# EAGLE design Freescale_Dev_2G_no_usb (EAGLE 5.08)
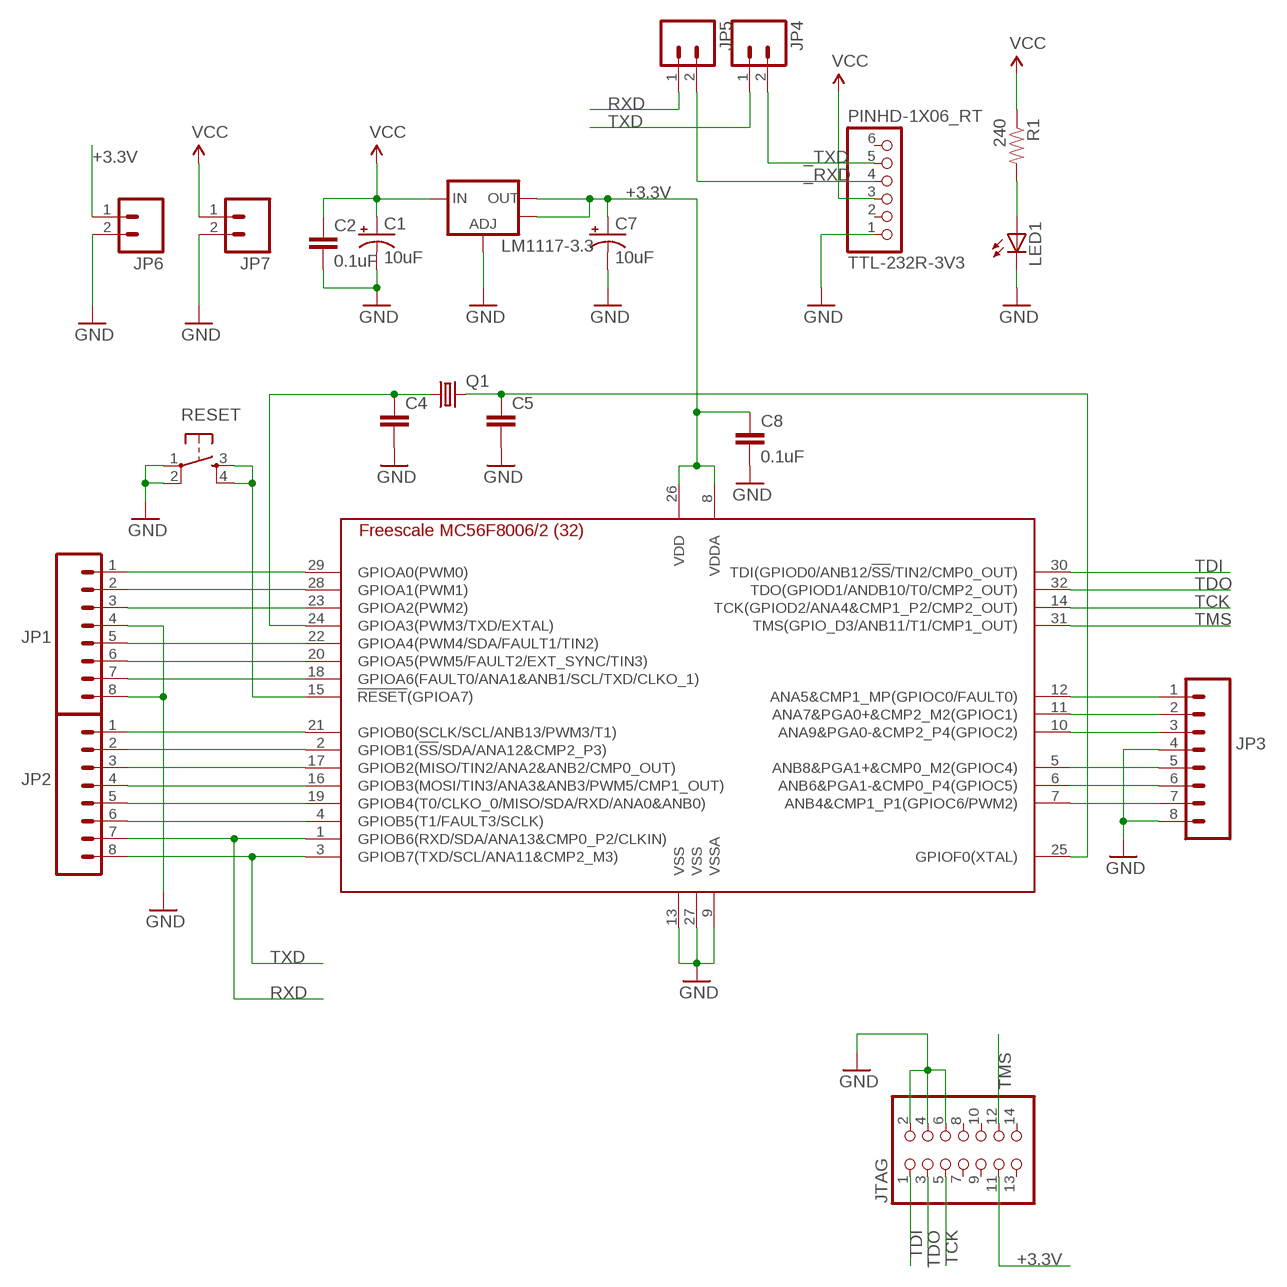
[diagram p0: schematic, sheet 1]

## Parts
C1  10uF  CAP_POL1206  [EIA3216]
C2  0.1uF  CAP0603-CAP  [0603-CAP]
C4  CAP0805  [0805]
C5  CAP0805  [0805]
C7  10uF  CAP_POL1206  [EIA3216]
C8  0.1uF  CAP0603-CAP  [0603-CAP]
JP1  M08LOCK  [1X08_LOCK]
JP2  M08LOCK  [1X08_LOCK]
JP3  M08LOCK  [1X08_LOCK]
JP4  M02PTH  [1X02]
JP5  M02PTH  [1X02]
JP6  M02PTH  [1X02]
JP7  M02PTH  [1X02]
JTAG  PINHD-2X7  [2X07]
LED1  LED1206  [LED-1206]
LM1117-3.3  V_REG_LM1117SOT223  [SOT223]
Q1  CRYSTALHC49UV  [HC49U-V]
R1  240  RESISTOR1206  [1206]
RESET  TAC_SWITCHPTH  [TACTILE-PTH]
TTL-232R-3V3  PINHD-1X06_RT  [1X06_90]
U$1  MC56F8006VLC  [TQFP32-08]

## Nets
+3.3V: C7.A(+) C8.1 JP6.1 JTAG.11 LM1117-3.3.2(OUT) LM1117-3.3.4(OUT) U$1.8(VDDA) U$1.26(VDD)
_RXD: JP5.2 TTL-232R-3V3.4
_TXD: JP4.2 TTL-232R-3V3.5
GND: C1.C(-) C2.2 C4.2 C5.2 C7.C(-) C8.2 JP1.4 JP1.8 JP3.4 JP3.8 JP6.2 JP7.2 JTAG.2 JTAG.4 JTAG.6 LED1.C LM1117-3.3.1(ADJ) RESET.1 RESET.2 TTL-232R-3V3.1 U$1.9(VSSA) U$1.13(VSS) U$1.27(VSS)
HSYNC: JP3.1 U$1.12(ANA5&CMP1_MP(GPIOC0/FAULT0))
N$2: LED1.A R1.2
N$9: JP1.7 U$1.18(GPIOA6(FAULT0/ANA1&ANB1/SCL/TXD/CLKO_1))
N$13: JP3.3 U$1.10(ANA9&PGA0-&CMP2_P4(GPIOC2))
N$14: JP3.6 U$1.6(ANB6&PGA1-&CMP0_P4(GPIOC5))
N$15: JP3.5 U$1.5(ANB8&PGA1+&CMP0_M2(GPIOC4))
N$16: JP2.5 U$1.19(GPIOB4(T0/CLKO_0/MISO/SDA/RXD/ANA0&ANB0))
N$17: JP2.6 U$1.4(GPIOB5(T1/FAULT3/SCLK))
N$20: JP1.1 U$1.29(GPIOA0(PWM0))
N$21: JP1.2 U$1.28(GPIOA1(PWM1))
N$22: RESET.3 RESET.4 U$1.15(!RESET!(GPIOA7))
N$27: JP2.1 U$1.21(GPIOB0(SCLK/SCL/ANB13/PWM3/T1))
N$28: JP2.2 U$1.2(GPIOB1(!SS!/SDA/ANA12&CMP2_P3))
N$29: JP2.3 U$1.17(GPIOB2(MISO/TIN2/ANA2&ANB2/CMP0_OUT))
N$30: JP2.4 U$1.16(GPIOB3(MOSI/TIN3/ANA3&ANB3/PWM5/CMP1_OUT))
N$32: C5.1 Q1.2 U$1.25(GPIOF0(XTAL))
N$48: JP1.3 U$1.23(GPIOA2(PWM2))
N$49: JP3.7 U$1.7(ANB4&CMP1_P1(GPIOC6/PWM2))
N$50: C4.1 Q1.1 U$1.24(GPIOA3(PWM3/TXD/EXTAL))
N$51: JP1.5 U$1.22(GPIOA4(PWM4/SDA/FAULT1/TIN2))
N$52: JP1.6 U$1.20(GPIOA5(PWM5/FAULT2/EXT_SYNC/TIN3))
RXD: JP2.7 JP5.1 U$1.1(GPIOB6(RXD/SDA/ANA13&CMP0_P2/CLKIN))
TCK: JTAG.5 U$1.14(TCK(GPIOD2/ANA4&CMP1_P2/CMP2_OUT))
TDI: JTAG.1 U$1.30(TDI(GPIOD0/ANB12/!SS!/TIN2/CMP0_OUT))
TDO: JTAG.3 U$1.32(TDO(GPIOD1/ANDB10/T0/CMP2_OUT))
TMS: JTAG.12 U$1.31(TMS(GPIO_D3/ANB11/T1/CMP1_OUT))
TXD: JP2.8 JP4.1 U$1.3(GPIOB7(TXD/SCL/ANA11&CMP2_M3))
VCC: C1.A(+) C2.1 JP7.1 LM1117-3.3.3(IN) R1.1 TTL-232R-3V3.3
VSYNC: JP3.2 U$1.11(ANA7&PGA0+&CMP2_M2(GPIOC1))
Unconnected: JTAG.7 JTAG.8 JTAG.9 JTAG.10 JTAG.13 JTAG.14 TTL-232R-3V3.2 TTL-232R-3V3.6

## Library data of the parts
C1 C7 = SparkFun:CAP_POL: Capacitor Polarized These are standard SMD and PTH capacitors. Normally 10uF, 47uF, and 100uF in electrolytic and tantalum varieties. Always verify the external diameter of the through hole cap, it varies with capacity, voltage, and manufacturer. The EIA devices should be standard.
C2 C4 C5 C8 = SparkFun:CAP: Capacitor Standard 0603 ceramic capacitor, and 0.1" leaded capacitor.
JP1-JP3 = SparkFun:M08: Header 8 Standard 8-pin 0.1" header. Use with straight break away headers (SKU : PRT-00116), right angle break away headers (PRT-00553), swiss pins (PRT-00743), machine pins (PRT-00117), and female headers (PRT-00115).
JP4-JP7 = SparkFun:M02: Header 2 Standard 2-pin 0.1" header. Use with straight break away headers (SKU : PRT-00116), right angle break away headers (PRT-00553), swiss pins (PRT-00743), machine pins (PRT-00117), and female headers (PRT-00115). Molex polarized connector foot print use with SKU : PRT-08233 with associated crimp pins and housings.
JTAG = pinhead:PINHD-2X7: PIN HEADER
LED1 = SparkFun:LED: LEDs Standard schematic elements and footprints for 5mm, 3mm, 1206, and 0603 sized LEDs. 5mm - Spark Fun Electronics SKU : COM-00529 (and others)
LM1117-3.3 = SparkFun:V_REG_LM1117: Voltage Regulator LM1117 Standard adjustable voltage regulator but in SMD form. Spark Fun Electronics SKU : COM-00595
Q1 = SparkFun:CRYSTAL: Crystals Various standard crystals. Proven footprints. Spark Fun Electronics SKU : COM-00534
R1 = SparkFun:RESISTOR: Resistor Basic schematic elements and footprints for 0603, 1206, and PTH 1/10th watt (small) resistors.
RESET = SparkFun:TAC_SWITCH: Momentary Switch Button commonly used for reset or general input. Spark Fun Electronics SKU : COM-00097
TTL-232R-3V3 = pinhead:PINHD-1X06_RT
U$1 = Atari:MC56F8006VLC: MC56F800x: MC56F8006 and MCF56F8002 Digital Signal Controllers <https://www.freescale.com/webapp/sps/site/prod_summary.jsp?code=MC56F800x> The devices in the MC56F8006 series are members of Freescale's family of digital signal controllers (DSCs). The entry-level MC56F8006/2 DSC provides the most cost-optimized solution for mathematically-intensive, power-sensitive real-time control applications.

## Board
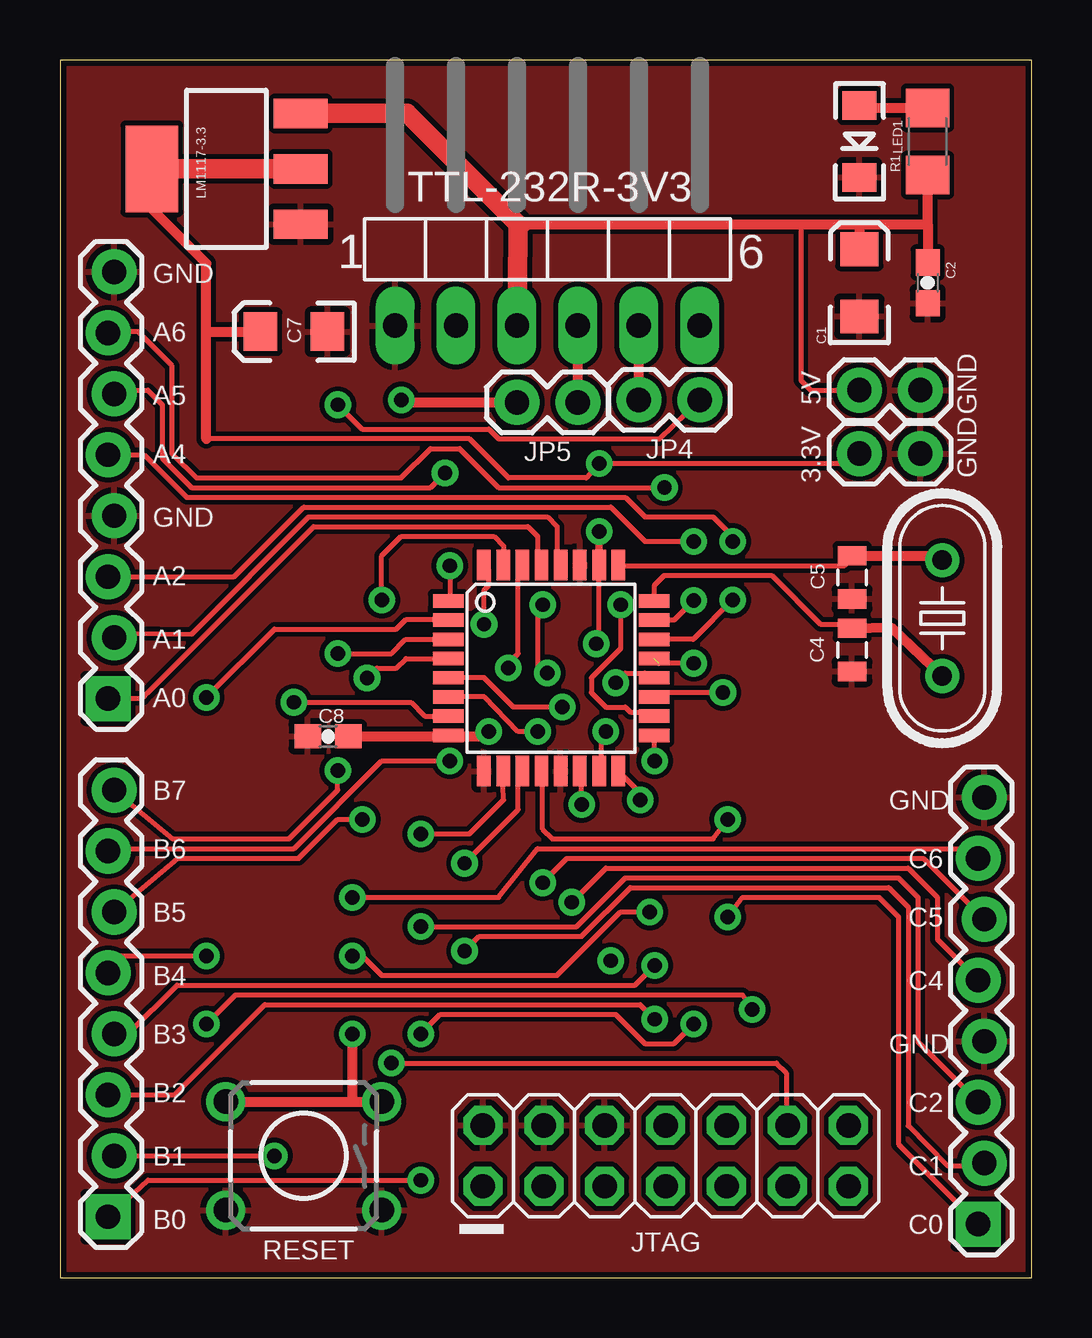
[diagram p1: board, top side]
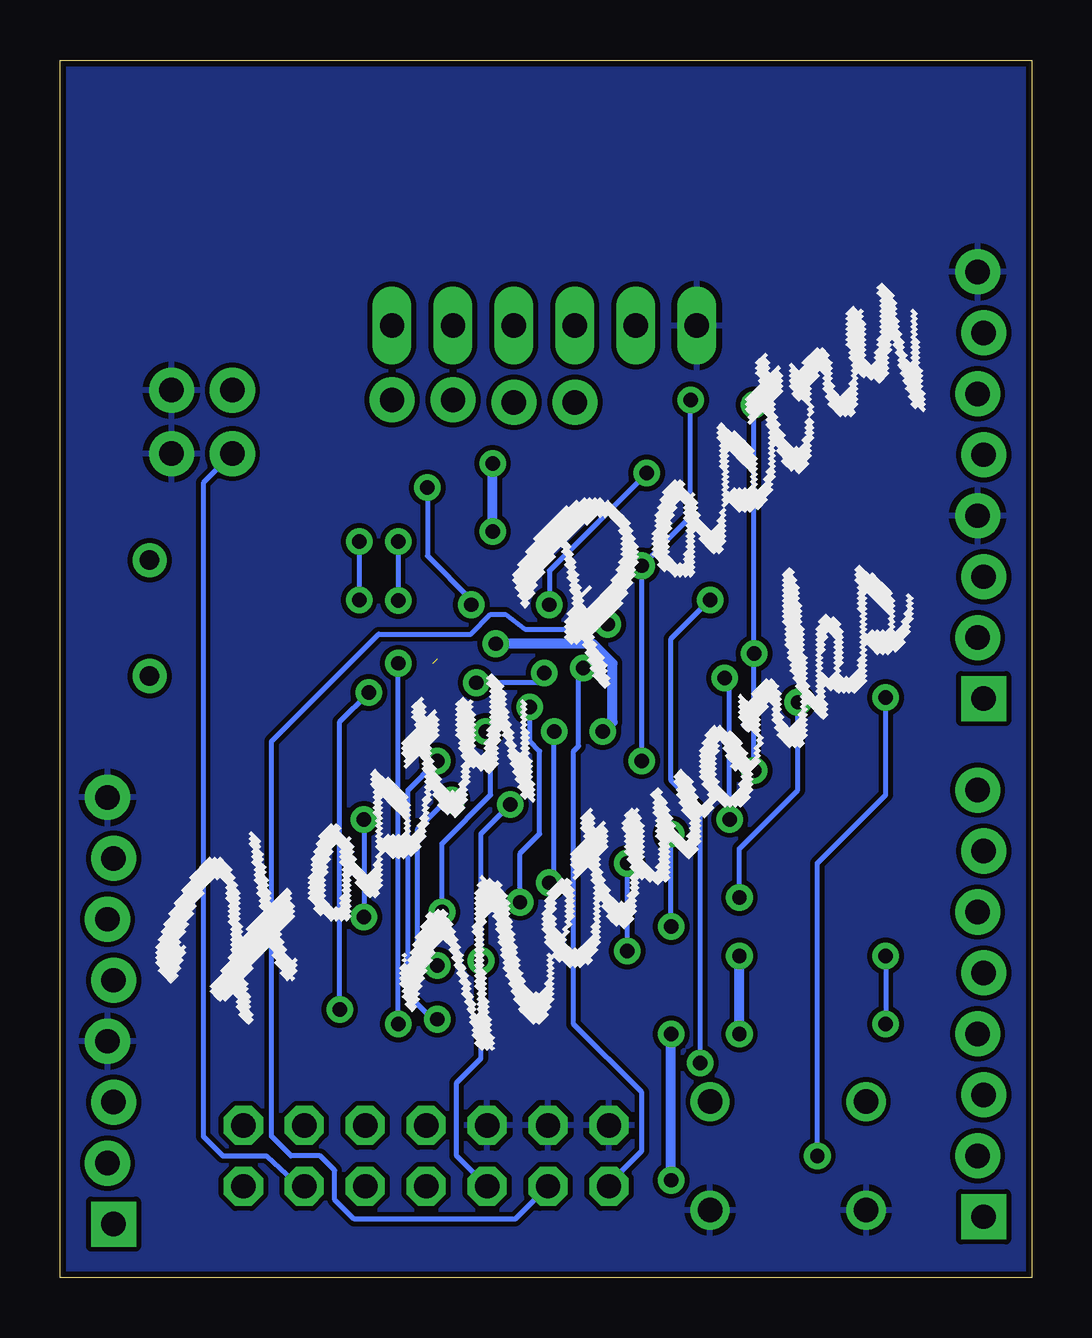
[diagram p2: board, bottom side, seen from below]

Size 40.51 x 50.74 mm. Coordinates in mm from the lower left corner, seen from the top.
Outline: 0,0 40.51,0 40.51,50.74 0,50.74 0,0
Copper layers (1*16): Top 0.035mm / dielectric 1.5mm / Bottom 0.035mm
Design rules "SparkFun": minimum track width 8mil, minimum drill 20mil, track to track 8mil, track to pad 8mil, pad to pad 8mil, via to via 8mil, smd to smd 8mil, copper to edge 10mil, drill to drill 8mil, minimum pad ring 12mil, minimum via ring 10mil, stop-mask expansion 4mil, vias tented up to drill 25mil, thermal gap 10mil

### Footprints (pad centres in the part's own frame; a part is rotated, then mirrored left to right if it is on the bottom)
EIA3216 = smd 1.4 x 1.6: A 1.4,0; C -1.4,0
0603-CAP = smd 1.1 x 1: 1 -0.85,0; 2 0.85,0
0805 = smd 0.8 x 1.2: 1 -0.9,0; 2 0.9,0
1X08_LOCK = drill 1.016 pad 1.88 square: 1 0,0.127 | drill 1.016 pad 1.88 round: 2 2.54,-0.127; 3 5.08,0.127; 4 7.62,-0.127; 5 10.16,0.127; 6 12.7,-0.127; 7 15.24,0.127; 8 17.78,-0.127
1X02 = drill 1.016 pad 1.88 round: 1 0,0; 2 2.54,0
2X07 = drill 1.016 octagon: 1 -7.62,-1.27; 2 -7.62,1.27; 3 -5.08,-1.27; 4 -5.08,1.27; 5 -2.54,-1.27; 6 -2.54,1.27; 7 0,-1.27; 8 0,1.27; 9 2.54,-1.27; 10 2.54,1.27; 11 5.08,-1.27; 12 5.08,1.27; 13 7.62,-1.27; 14 7.62,1.27
LED-1206 = smd 1.2 x 1.4: A -1.5,0; C 1.5,0
SOT223 = smd 1.219 x 2.235: 1 -2.311,-3.099; 2 0,-3.099; 3 2.311,-3.099 | smd 3.6 x 2.2: 4 0,3.099
HC49U-V = drill 0.813 round: 1 -2.413,0; 2 2.413,0
1206 = smd 1.6 x 1.8: 1 -1.4,0; 2 1.4,0
TACTILE-PTH = drill 1.016 round: 1 -3.251,2.261; 2 3.251,2.261; 3 -3.251,-2.261; 4 3.251,-2.261
1X06_90 = drill 1.016 long: 1 -6.35,-3.81; 2 -3.81,-3.81; 3 -1.27,-3.81; 4 1.27,-3.81; 5 3.81,-3.81; 6 6.35,-3.81
TQFP32-08 = smd 1.27 x 0.559: 1 -4.293,2.8; 2 -4.293,2; 3 -4.293,1.2; 4 -4.293,0.4; 5 -4.293,-0.4; 6 -4.293,-1.2; 7 -4.293,-2; 8 -4.293,-2.8; 17 4.293,-2.8; 18 4.293,-2; 19 4.293,-1.2; 20 4.293,-0.4; 21 4.293,0.4; 22 4.293,1.2; 23 4.293,2; 24 4.293,2.8 | smd 0.559 x 1.27: 9 -2.8,-4.293; 10 -2,-4.293; 11 -1.2,-4.293; 12 -0.4,-4.293; 13 0.4,-4.293; 14 1.2,-4.293; 15 2,-4.293; 16 2.8,-4.293; 25 2.8,4.293; 26 2,4.293; 27 1.2,4.293; 28 0.4,4.293; 29 -0.4,4.293; 30 -1.2,4.293; 31 -2,4.293; 32 -2.8,4.293

### Placement (x,y rotation side)
C1  33.32,41.45 90 top
C2  36.17,41.45 270 top
C4  33.02,26.16 270 top
C5  33.02,29.18 270 top
C7  9.75,39.42 180 top
C8  11.18,22.56 180 top
JP1  2.13,24.13 90 top
JP2  2.13,2.54 90 top
JP3  38.4,2.24 90 top
JP4  26.67,36.58 180 top
JP5  19.05,36.47 0 top
JP6  33.32,34.34 0 top
JP7  33.32,36.98 0 top
JTAG  25.25,5.08 0 top
LED1  33.32,47.35 270 top
LM1117-3.3  6.93,46.2 90 top
Q1  36.78,27.48 90 top
R1  36.17,47.35 90 top
RESET  10.16,5.08 180 top
TTL-232R-3V3  20.32,43.48 0 top
U$1  20.47,25.4 0 top
U$2  [HP_LOGO_SM]  17.07,23.57 45 bottom

### Tracks (layer width: path | path; a pad name or v marks a point on that pad's centre or on a via)
+3.3V  (via drill 0.6)
  Top 0.203: 22.35,29.67 U$1.26 22.47,26.54 v22.35,26.42 | 16.26,22.55 U$1.8 arc-90 16.14,22.55 | 6.1,34.95 17.07,34.95 18.69,33.33 21.95,33.33 v22.48,33.93 32.92,33.93 JP6.1 | 3.83,44.53 LM1117-3.3.4
  Top 0.305: U$1.26 22.47,31.29
  Top 0.406: 6.1,34.95 6.1,39.42 | 6.1,39.42 6.1,42.27 3.83,44.53 | 16.26,22.55 17.68,22.55 v17.88,22.76 | C8.1 16.14,22.55 | 6.1,39.42 C7.A | 22.47,31.29 v22.48,31.09
  Top 0.813: LM1117-3.3.4 LM1117-3.3.2
  Bottom 0.203: JTAG.11 30.53,3.81 31.9,5.08 33.73,5.08 34.54,5.89 34.54,33.12 JP6.1
  Bottom 0.406: v17.88,22.76 17.48,23.16 17.48,25.6 18.29,26.42 v22.35,26.42 | v22.48,31.09 v22.48,33.93
_RXD
  Top 0.406: JP5.2 TTL-232R-3V3.4
_TXD
  Top 0.406: JP4.2 TTL-232R-3V3.5
GND
  pour Top: 0,50.55 40.44,50.55 40.44,0 0,0
  pour Bottom: 0.41,50.8 40.64,50.8 40.64,0 0,0 0,50.8
HSYNC  (via drill 0.6)
  Top 0.203: JP3.1 34.95,5.56 34.95,15.04 34.14,15.85 28.45,15.85 v27.84,15.04 | v27.84,19.1 27.23,18.29 20.52,18.29 20.12,18.69 20.12,21.06 U$1.12
  Bottom 0.203: v27.84,19.1 v27.84,15.04
N$2
  Top 0.406: LED1.A 33.42,48.75 R1.2
N$9  (via drill 0.6)
  Top 0.203: JP1.7 2.44,39.42 3.25,39.42 4.67,38 4.67,34.34 5.69,33.33 14.22,33.33 15.44,34.54 16.66,34.54 18.29,32.92 v25.2,32.92 | U$1.18 24.38,23.57 23.77,23.57 23.57,23.77 22.76,23.77 22.15,24.38 22.15,24.99 23.37,26.21 v23.37,28.04
  Bottom 0.203: v25.2,32.92 25.2,30.07 23.37,28.25 v23.37,28.04
N$13  (via drill 0.6)
  Top 0.203: JP3.3 35.76,9.83 35.76,15.85 34.95,16.66 23.57,16.66 21.54,14.63 v15.04,14.63 | U$1.10 18.47,20.5 18.49,19.91 17.07,18.49 v15.04,18.49
  Bottom 0.203: v15.04,14.63 v15.04,18.49
N$14  (via drill 0.6)
  Top 0.203: U$1.6 17.7,24.2 19.1,22.76 v19.91,22.76 | JP3.6 35.99,17.48 21.13,17.48 v20.12,16.46
  Bottom 0.203: v20.12,16.46 19.91,16.66 v19.91,22.76
N$15  (via drill 0.6)
  Top 0.203: U$1.5 17.67,25 18.9,23.77 v20.93,23.77 | JP3.5 36.58,14.1 36.58,15.85 35.36,17.07 22.76,17.07 v21.34,15.65
  Bottom 0.203: v21.34,15.65 21.34,17.68 20.52,18.49 20.52,21.95 20.93,22.35 v20.93,23.77
N$16  (via drill 0.6)
  Top 0.203: U$1.19 24.95,24.38 v27.64,24.38 | v6.1,13.41 2.52,13.41 JP2.5 | v6.1,10.57 7.32,11.79 28.45,11.79 v28.85,11.18
  Bottom 0.203: v28.85,11.18 28.85,23.16 v27.64,24.38 | v6.1,13.41 v6.1,10.57
N$17  (via drill 0.6)
  Top 0.203: JP2.6 4.9,17.48 9.96,17.48 11.58,19.1 v12.6,19.1 | v12.8,24.99 13.21,25.4 14.02,25.4 14.42,25.8 U$1.4
  Bottom 0.203: v12.6,19.1 12.6,24.79 v12.8,24.99
N$20
  Top 0.203: JP1.1 2.44,24.38 2.62,24.16 3.45,24.16 3.66,24.38 10.57,31.29 19.51,31.29 19.91,30.89 19.91,29.85 U$1.29
N$21
  Top 0.203: JP1.2 2.85,26.85 5.49,26.82 10.36,31.7 20.32,31.7 20.73,31.29 20.73,29.84 U$1.28 20.87,29.93
N$22  (via drill 0.6)
  Top 0.203: U$1.15 22.55,21.23 22.55,22.55 v22.76,22.76 | v24.59,15.24 23.37,15.24 20.73,12.6 13.41,12.6 12.6,13.41 v12.19,13.41
  Top 0.406: RESET.4 12.19,7.34 | 12.19,7.34 RESET.3 | 12.19,7.34 v12.19,10.16
  Bottom 0.203: v22.76,22.76 22.55,22.55 22.55,20.12 24.59,18.09 v24.59,15.24
  Bottom 0.406: v12.19,10.16 v12.19,13.41
N$27  (via drill 0.6)  (1 unrouted)
  Top 0.203: JP2.1 3.66,4.06 v15.04,4.06 | v15.04,10.16 15.85,10.97 23.16,10.97 24.38,9.75 25.6,9.75 v26.42,10.57 | v26.42,25.6 24.96,25.6
  Bottom 0.203: v26.42,10.57 v26.42,25.6
  Bottom 0.406: v15.04,4.06 v15.04,10.16
N$28  (via drill 0.6)
  Top 0.203: JP2.2 v8.94,5.08 | v6.1,24.18 8.94,27.03 14.02,27.03 14.43,27.43 16.15,27.43 arc-90 U$1.2
  Bottom 0.203: v8.94,5.08 8.94,17.27 6.1,20.12 v6.1,24.18
N$29  (via drill 0.6)
  Top 0.203: v24.79,21.54 24.79,22.57 U$1.17 | JP2.3 4.78,7.62 8.53,11.38 24.18,11.38 v24.79,10.77
  Bottom 0.203: v24.79,10.77 25.2,10.97 26.01,11.79 26.01,20.32 v24.79,21.54
N$30  (via drill 0.6)
  Top 0.203: v24.79,13.01 23.98,12.19 4.88,12.19 2.85,10.16 JP2.4 | U$1.16 24.18,20.2 v24.18,19.91
  Bottom 0.203: v24.79,13.01 25.6,13.82 25.6,18.69 24.38,19.91 v24.18,19.91
N$32
  Top 0.203: U$1.25 23.3,29.67 32.72,29.67 33.11,30.07 C5.1 | 36.59,30.09 Q1.2
  Top 0.406: C5.1 36.59,30.09
N$48  (via drill 0.6)
  Top 0.203: v26.42,30.68 24.38,30.68 22.96,32.11 10.16,32.11 7.26,29.21 JP1.3 | U$1.23 25.6,27.4 v26.42,28.21
  Bottom 0.203: v26.42,30.68 v26.42,28.21
N$49  (via drill 0.6)
  Top 0.203: U$1.7 15.21,23.4 14.63,23.98 v9.75,23.98 | v12.19,15.85 18.29,15.85 19.91,17.88 37.87,17.88 JP3.7
  Bottom 0.203: v9.75,23.98 9.75,20.32 12.19,17.88 v12.19,15.85
N$50
  Top 0.203: U$1.24 24.79,28.23 24.79,28.85 25.2,29.26 29.67,29.26 31.7,27.23 32.88,27.23 C4.1
  Top 0.406: C4.1 34.63,27.1 Q1.1
N$51  (via drill 0.6)
  Top 0.203: v28.04,30.68 28.04,30.89 27.23,31.7 24.38,31.7 23.57,32.51 5.28,32.51 3.5,34.29 JP1.5 | v28.04,28.25 26.4,26.6 U$1.22
  Bottom 0.203: v28.04,30.68 v28.04,28.25
N$52  (via drill 0.6)
  Top 0.203: v16.05,33.53 15.44,32.92 5.49,32.92 4.27,34.14 4.27,36.37 3.66,36.98 2.85,36.98 JP1.6 | v20.12,28.04 19.91,27.84 19.91,25.4 20.12,25.2 v20.32,25.2 | v23.16,24.79 23.57,25.2 24.38,25.2 U$1.20
  Bottom 0.203: v16.05,33.53 20.12,29.46 v20.12,28.04 | v20.32,25.2 20.32,24.79 v23.16,24.79
RXD  (via drill 0.6)
  Top 0.203: JP2.7 2.52,17.88 9.75,17.88 13.41,21.54 v16.26,21.54 | 16.26,28.28 U$1.1 16.02,28.2 16.26,28.37 v16.26,29.67
  Top 0.406: v14.22,36.58 14.33,36.47 JP5.1
  Bottom 0.203: v16.26,21.54 v16.26,29.67 14.22,31.7 v14.22,36.58
TCK  (via drill 0.6)
  Top 0.203: U$1.14 21.74,20.97 v21.74,19.71
  Bottom 0.203: v21.74,19.71 22.96,18.49 v22.96,13.21 22.96,9.14 23.98,8.13 23.98,5.08 JTAG.5
TDI  (via drill 0.6)
  Top 0.203: U$1.30 19.1,29.52 19.1,26.01 18.69,25.6 v18.69,25.4
  Bottom 0.203: v18.69,25.4 18.9,25.2 18.9,22.15 19.1,21.95 19.1,10.57 16.26,7.72 16.26,5.28 17.63,3.91 JTAG.1
TDO  (via drill 0.6)
  Top 0.203: U$1.32 17.88,29.48 17.88,28.85 17.68,28.65 v17.68,27.23
  Bottom 0.203: v17.68,27.23 17.88,27.03 21.13,27.03 21.95,27.64 22.55,27.64 23.37,26.82 27.23,26.82 31.7,22.35 31.7,5.89 30.89,5.08 29.67,5.08 29.06,4.47 29.06,3.25 28.25,2.44 21.54,2.44 JTAG.3
TMS  (via drill 0.6)
  Top 0.203: U$1.31 18.49,29.88 18.49,30.48 18.09,30.89 14.22,30.89 13.41,30.07 v13.41,28.25 | v13.82,8.94 29.87,8.94 30.28,8.53 30.28,6.4 JTAG.12
  Bottom 0.203: v13.41,28.25 15.04,26.62 15.04,20.73 13.82,19.51 v13.82,8.94
TXD  (via drill 0.6)
  Top 0.203: v11.58,26.01 13.82,26.01 14.41,26.6 U$1.3 | JP2.8 4.7,18.29 9.55,18.29 11.58,20.32 v11.58,21.13 | v11.58,36.37 12.6,35.36 17.88,35.36 18.29,34.95 24.99,34.95 JP4.1
  Bottom 0.203: v11.58,21.13 v11.58,26.01 v11.58,36.37
VCC
  Top 0.203: JP7.1 31.29,36.98 30.89,37.39 30.89,43.89
  Top 0.406: 19.1,43.48 19.51,43.89 30.89,43.89 33.33,43.89 | 33.33,43.89 C1.A | 33.33,43.89 36.17,43.89 | 36.17,43.89 C2.1 | 36.17,43.89 R1.1
  Top 0.813: TTL-232R-3V3.3 19.1,43.48 19.1,43.89 14.48,48.51 LM1117-3.3.3
VSYNC  (via drill 0.6)
  Top 0.203: JP3.2 38.43,4.67 36.98,4.67 35.36,6.33 35.36,15.44 34.54,16.26 23.77,16.26 21.74,14.22 17.48,14.22 v16.87,13.61 | v16.87,17.27 19.1,19.51 19.1,20.73 19.27,20.9 U$1.11
  Bottom 0.203: v16.87,13.61 v16.87,17.27

### Text on the board
tPlace: GND | A6 | A5 | 5V | GND | A4 | 3.3V | GND | GND | A2 | A1 | A0 | B7 | GND | B6 | C6 | B5 | C5 | B4 | C4 | B3 | GND | B2 | C2 | B1 | C1 | B0 | C0
tNames: 1 | 6